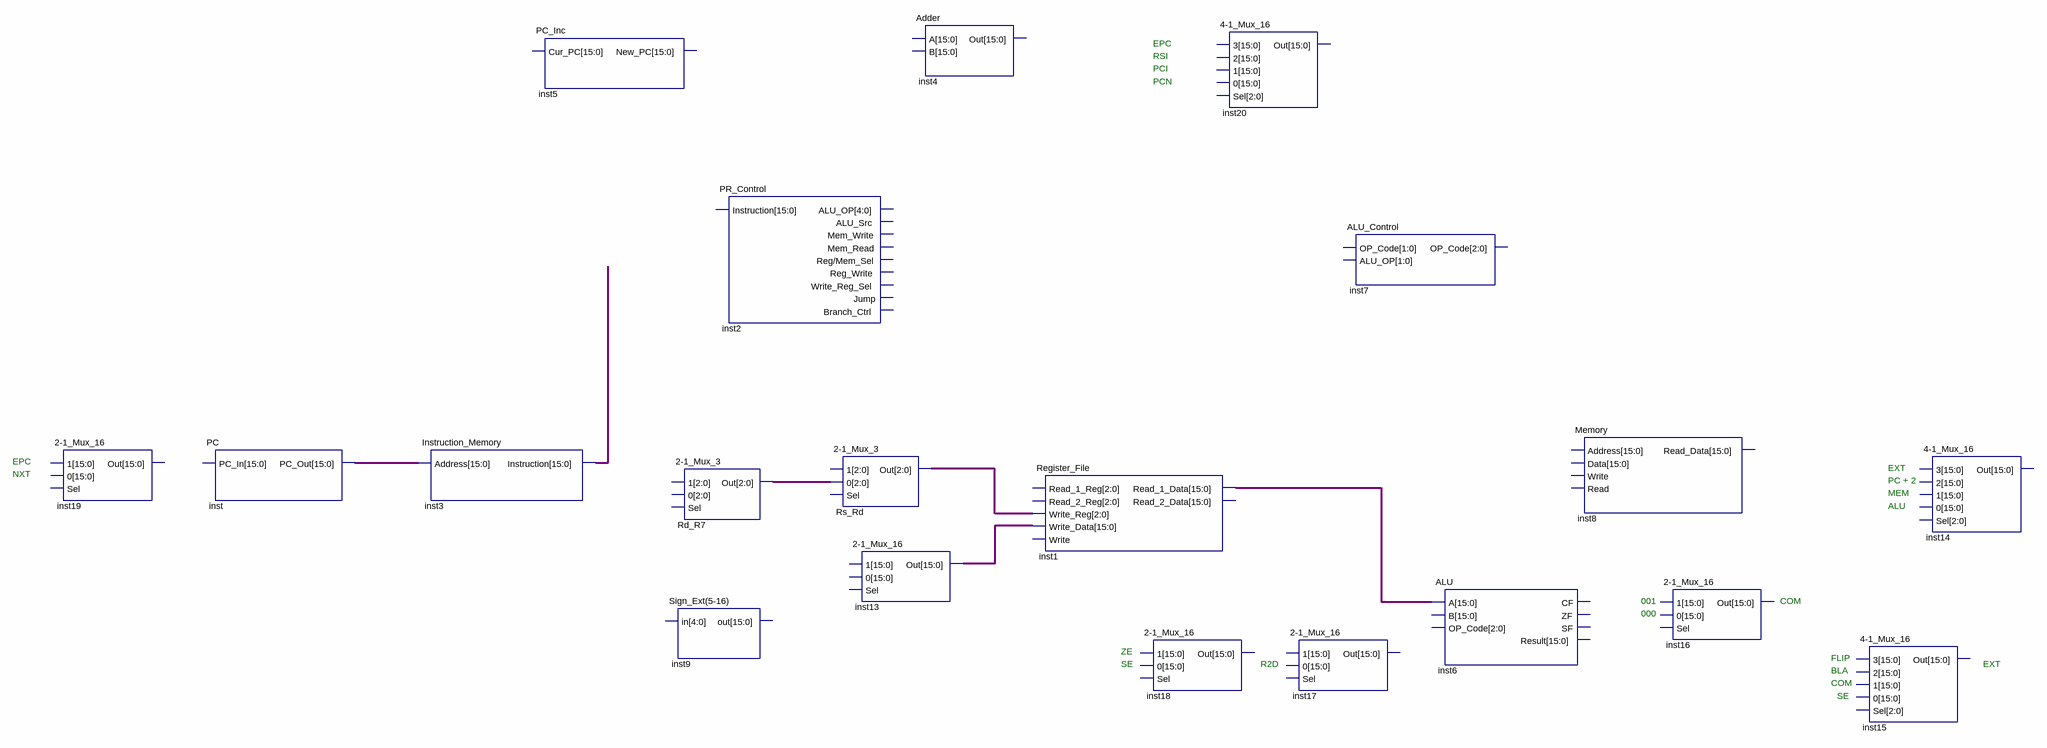
[diagram p0: schematic sheet]
// Quartus schematic Processor(2).bdf as structural Verilog: 20 symbols, 0 pins
module \Processor(2)  (
);

  wire [2:0] Rd_R7_out, Rs_Rd_out;
  wire [15:0] inst1_read_1_data, inst3_instruction, inst13_out, inst_pc_out;

  \2-1_Mux_16  inst19 ();  // open: 1, 0, Sel, Out
  PC inst (.PC_Out(inst_pc_out));  // open: PC_In
  Instruction_Memory inst3 (.Address(inst_pc_out), .Instruction(inst3_instruction));
  PC_Inc inst5 ();  // open: Cur_PC, New_PC
  \2-1_Mux_3  Rd_R7 (.Out(Rd_R7_out));  // open: 1, 0, Sel
  \Sign_Ext(5-16)  inst9 ();  // open: in, out
  PR_Control inst2 ();  // open: Instruction, ALU_OP, ALU_Src, Mem_Write, Mem_Read, Reg/Mem_Sel, Reg_Write, Write_Reg_Sel, Jump, Branch_Ctrl
  \2-1_Mux_3  Rs_Rd (.\0 (Rd_R7_out), .Out(Rs_Rd_out));  // open: 1, Sel
  \2-1_Mux_16  inst13 (.Out(inst13_out));  // open: 1, 0, Sel
  Adder inst4 ();  // open: A, B, Out
  Register_File inst1 (
    .Write_Reg(Rs_Rd_out), .Write_Data(inst13_out), .Read_1_Data(inst1_read_1_data));  // open: Read_1_Reg, Read_2_Reg, Write, Read_2_Data
  \2-1_Mux_16  inst18 ();  // open: 1, 0, Sel, Out
  \4-1_Mux_16  inst20 ();  // open: 3, 2, 1, 0, Sel, Out
  \2-1_Mux_16  inst17 ();  // open: 1, 0, Sel, Out
  ALU_Control inst7 ();  // open: OP_Code, ALU_OP
  ALU inst6 (.A(inst1_read_1_data));  // open: B, OP_Code, CF, ZF, SF, Result
  Memory inst8 ();  // open: Address, Data, Write, Read, Read_Data
  \2-1_Mux_16  inst16 ();  // open: 1, 0, Sel, Out
  \4-1_Mux_16  inst15 ();  // open: 3, 2, 1, 0, Sel, Out
  \4-1_Mux_16  inst14 ();  // open: 3, 2, 1, 0, Sel, Out

  // Notes on the sheet:
  //   EPC
  //   RSI
  //   PCI
  //   PCN
  //   EPC
  //   EXT
  //   NXT
  //   PC + 2
  //   MEM
  //   ALU
  //   001
  //   COM
  //   000
  //   ZE
  //   FLIP
  //   SE
  //   R2D
  //   EXT
  //   BLA
  //   COM
  //   SE
endmodule
